# EAGLE design Laptimer (EAGLE 6.3)
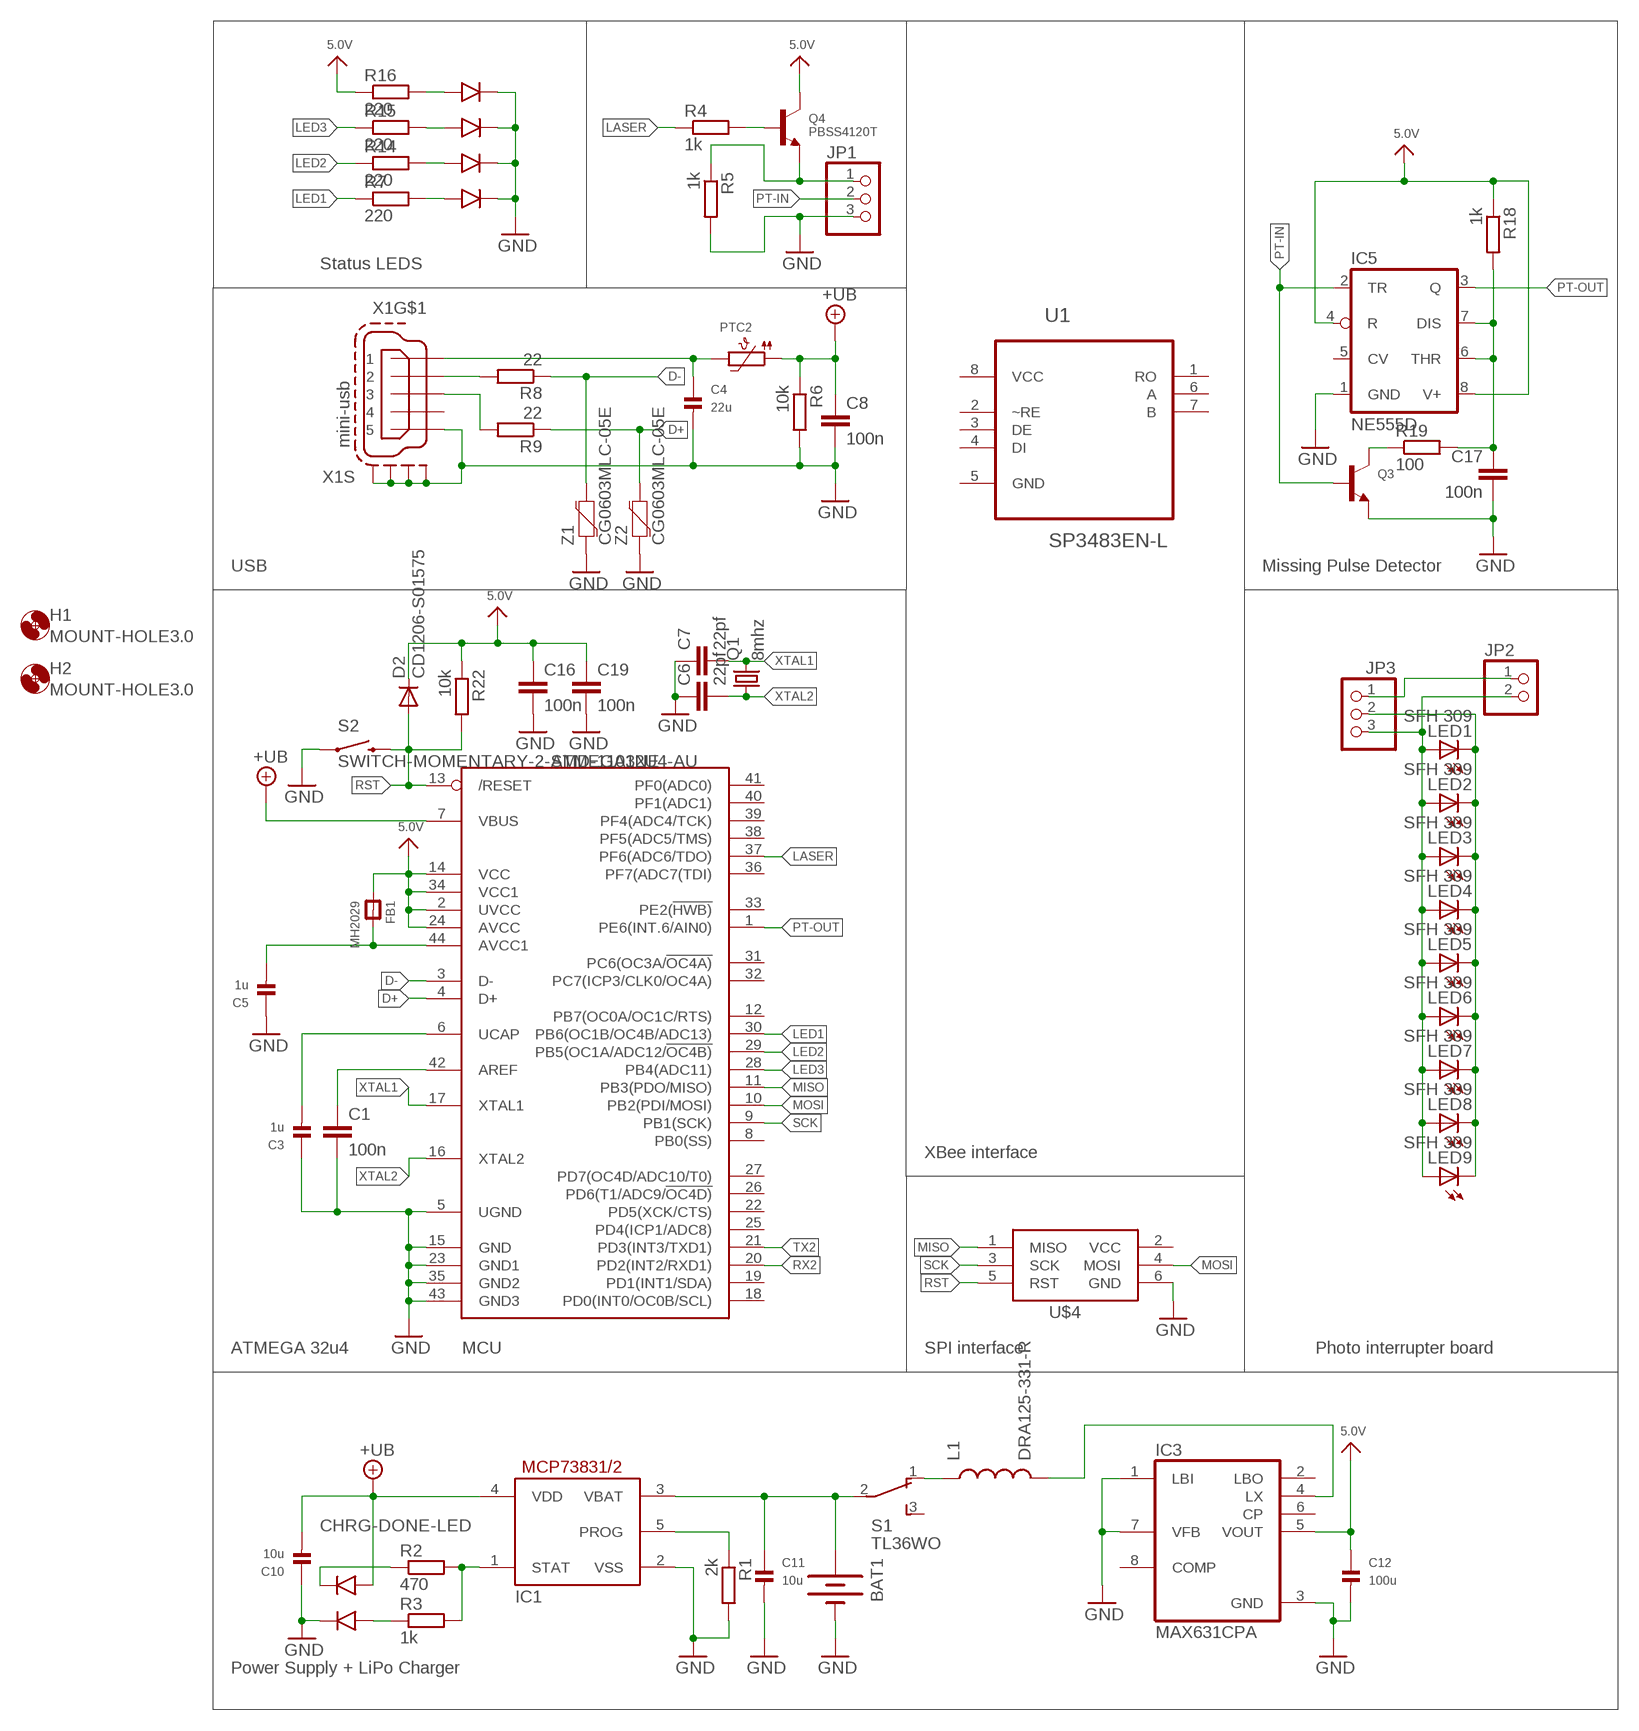
[diagram p0: schematic, sheet 1]

## Parts
BAT1  BATTERY18650  [BATTERY_18650-HOLDER]
C1  100n  C-EUC0603K  [C0603K]
C3  1u  CAP_CERAMIC_0805MP  [_0805MP]
C4  22u  CAP_CERAMIC_0805MP  [_0805MP]
C5  1u  CAP_CERAMIC_0805MP  [_0805MP]
C6  22pf  C-EUC0603K  [C0603K]
C7  22pf  C-EUC0603K  [C0603K]
C8  100n  C-EUC0603K  [C0603K]
C10  10u  CAP_CERAMIC_0805MP  [_0805MP]
C11  10u  CAP_CERAMIC_0805MP  [_0805MP]
C12  100u  CAP_CERAMIC1206  [1206]
C16  100n  C-EUC0603K  [C0603K]
C17  100n  C-EUC0603K  [C0603K]
C19  100n  C-EUC0603K  [C0603K]
D2  CD1206-S01575  DIODE-MINIMELF  [MINIMELF]
FB1  MH2029  FERRITE_0805MP  [_0805MP]
H1  MOUNT-HOLE3.0  [3,0]
H2  MOUNT-HOLE3.0  [3,0]
IC1  MCP73831/OT  [SOT23-5L]
IC3  MAX631CPA  [DIL08]
IC5  NE555D  [SO08]
JP1  PINHD-1X3  [1X03]
JP2  HEADER-1X2ROUND  [1X02_ROUND]
JP3  PINHD-1X3  [1X03]
L1  DRA125-331-R  INDUCTORPWR  [CDRH125]
LED1  SFH 309  LED3MM  [LED3MM]
LED2  SFH 309  LED3MM  [LED3MM]
LED3  SFH 309  LED3MM  [LED3MM]
LED4  SFH 309  LED3MM  [LED3MM]
LED5  SFH 309  LED3MM  [LED3MM]
LED6  SFH 309  LED3MM  [LED3MM]
LED7  SFH 309  LED3MM  [LED3MM]
LED8  SFH 309  LED3MM  [LED3MM]
LED9  SFH 309  LED3MM  [LED3MM]
MCU  ATMEGA32U4-AU  [TQFP44]
PTC2  PTC1206  [1206]
Q1  8mhz  CRYSTALHC49S  [HC49/S]
Q3  TRANSISTOR_NPNWIDE  [SOT23-WIDE]
Q4  PBSS4120T  TRANSISTOR_NPNWIDE  [SOT23-WIDE]
R1  2k  R-EU_R0603  [R0603]
R2  470  R-EU_R0603  [R0603]
R3  1k  R-EU_R0603  [R0603]
R4  1k  R-EU_R0603  [R0603]
R5  1k  R-EU_R0603  [R0603]
R6  10k  R-EU_R0603  [R0603]
R7  220  R-EU_R0603  [R0603]
R8  22  R-EU_R0603  [R0603]
R9  22  R-EU_R0603  [R0603]
R14  220  R-EU_R0603  [R0603]
R15  220  R-EU_R0603  [R0603]
R16  220  R-EU_R0603  [R0603]
R18  1k  R-EU_R0603  [R0603]
R19  100  R-EU_R0603  [R0603]
R22  10k  R-EU_R0603  [R0603]
S1  TL36WO  [TL3XWO]
S2  SWITCH-MOMENTARY-2-SMD-1101NE  [TACTILE-SWITCH-1101NE]
U1  SP3483EN-L  [SOIC127P600X175-8N]
U$1  BI-LEVEL-LED-INDICATOR  [BI-LEVEL-LED-INDICATOR]
U$4  AVRISP-BOX  [AVRISP-BOX]
U$18  BI-LEVEL-LED-INDICATOR  [BI-LEVEL-LED-INDICATOR]
U$19  BI-LEVEL-LED-INDICATOR  [BI-LEVEL-LED-INDICATOR]
X1  mini-usb  MINI-USB-SCHIELD-32005-301  [32005-301]
Z1  CG0603MLC-05E  VARISTOR-0603  [0603-RES]
Z2  CG0603MLC-05E  VARISTOR-0603  [0603-RES]

## Nets
5.0V: C12.1 C16.1 C19.1 D2.C FB1.1 IC3.5(VOUT) IC5.4(R) IC5.8(V+) MCU.2(UVCC) MCU.14(VCC) MCU.24(AVCC) MCU.34(VCC1) Q4.3(C) R16.1 R18.1 R22.1
+UB: C8.1 C10.2 IC1.4(VDD) MCU.7(VBUS) PTC2.1 R6.1 U$1.ANODE1
CHRG-DONE-LED: R3.1 U$1.ANODE2
D+: MCU.4(D+) R9.1 Z2.2
D-: MCU.3(D-) R8.1 Z1.2
GND: BAT1.GND@1(-) C1.2 C3.1 C4.2 C5.1 C6.1 C7.1 C8.2 C10.1 C11.2 C12.2 C16.2 C17.2 C19.2 IC1.2(VSS) IC3.1(LBI) IC3.3(GND) IC3.7(VFB) IC5.1(GND) JP1.3 MCU.5(UGND) MCU.15(GND) MCU.23(GND1) MCU.35(GND2) MCU.43(GND3) Q3.2(E) R1.2 R5.2 R6.2 S2.P$1 U$1.CATHODE2 U$4.6(GND) U$18.CATHODE1 U$18.CATHODE2 U$19.CATHODE1 U$19.CATHODE2 X1.5 X1.M1(S:S1) X1.M2(S:S2) X1.M3(S:S3) X1.M4(S:S4) Z1.1 Z2.1
INT: JP3.2 LED1.K(C) LED2.K(C) LED3.K(C) LED4.K(C) LED5.K(C) LED6.K(C) LED7.K(C) LED8.K(C) LED9.K(C)
LASER: MCU.37(PF6(ADC6/TDO)) R4.1
LED1: MCU.30(PB6(OC1B/OC4B/ADC13)) R7.1
LED2: MCU.29(PB5(OC1A/ADC12/!OC4B)) R14.1
LED3: MCU.28(PB4(ADC11)) R15.1
MISO: MCU.11(PB3(PDO/MISO)) U$4.1(MISO)
MOSI: MCU.10(PB2(PDI/MOSI)) U$4.4(MOSI)
N$1: R9.2 X1.3
N$3: IC1.5(PROG) R1.1
N$4: IC1.1(STAT) R2.2 R3.2
N$5: JP1.1 Q4.2(E) R5.1
N$6: Q4.1(B) R4.2
N$7: C5.2 FB1.2 MCU.44(AVCC1)
N$9: C1.1 MCU.42(AREF)
N$10: JP2.1 JP3.1
N$12: C3.2 MCU.6(UCAP)
N$13: C4.1 PTC2.2 X1.1
N$14: R2.1 U$1.CATHODE1
N$15: R7.2 U$18.ANODE1
N$21: R14.2 U$18.ANODE2
N$24: IC3.4(LX) L1.2
N$25: R15.2 U$19.ANODE1
N$26: L1.1 S1.1(O)
N$27: R8.2 X1.2
N$31: BAT1.PWR@1(+) C11.1 IC1.3(VBAT) S1.2(P)
N$32: R16.2 U$19.ANODE2
N$36: C17.1 IC5.6(THR) IC5.7(DIS) R18.2 R19.2
N$40: JP2.2 JP3.3 LED1.A LED2.A LED3.A LED4.A LED5.A LED6.A LED7.A LED8.A LED9.A
N$41: Q3.3(C) R19.1
PT-IN: IC5.2(TR) JP1.2 Q3.1(B)
PT-OUT: IC5.3(Q) MCU.1(PE6(INT.6/AIN0))
RST: D2.A MCU.13(/RESET) R22.2 S2.P$2 U$4.5(RST)
RX2: MCU.20(PD2(INT2/RXD1))
SCK: MCU.9(PB1(SCK)) U$4.3(SCK)
TX2: MCU.21(PD3(INT3/TXD1))
XTAL1: C7.2 MCU.17(XTAL1) Q1.2
XTAL2: C6.2 MCU.16(XTAL2) Q1.1
Unconnected: IC3.2(LBO) IC3.6(CP) IC3.8(COMP) IC5.5(CV) MCU.8(PB0(SS)) MCU.12(PB7(OC0A/OC1C/RTS)) MCU.18(PD0(INT0/OC0B/SCL)) MCU.19(PD1(INT1/SDA)) MCU.22(PD5(XCK/CTS)) MCU.25(PD4(ICP1/ADC8)) MCU.26(PD6(T1/ADC9/!OC4D)) MCU.27(PD7(OC4D/ADC10/T0)) MCU.31(PC6(OC3A/!OC4A)) MCU.32(PC7(ICP3/CLK0/OC4A)) MCU.33(PE2(!HWB)) MCU.36(PF7(ADC7(TDI)) MCU.38(PF5(ADC5/TMS)) MCU.39(PF4(ADC4/TCK)) MCU.40(PF1(ADC1)) MCU.41(PF0(ADC0)) S1.3(S) U1.1(RO) U1.2(~RE) U1.3(DE) U1.4(DI) U1.5(GND) U1.6(A) U1.7(B) X1.4

## Notes on the sheet
- Status LEDS
- USB | Missing Pulse Detector
- XBee interface
- ATMEGA 32u4 | SPI interface | Photo interrupter board
- Power Supply + LiPo Charger

## Power pins joined to a net without a drawn wire
VCC: U1.8(VCC) U$4.2(VCC)

## Library data of the parts
BAT1 = SparkFun-Electromechanical:BATTERY: Battery Holders Various common sizes : AA, AAA, 18650 (PRT-12895), 20mm coin cell and 12mm coin cell. 20MM_4LEGS, BATT-10373
C1 C6-C8 C16 C17 C19 = rcl:C-EU: CAPACITOR, European symbol
C3-C5 C10-C12 = microbuilder:CAP_CERAMIC: Ceramic Capacitors 0402 - 0402 Surface Mount Capacitors 16pF 50V 5% [Digikey: 445-4899-2-ND] 18pF 50V 5% [Digikey: 490-1281-2-ND] 22pF 50V 5% [Digikey: 490-1283-2-ND] 68pF 50V 5% [Digikey: 490-1289-2-ND] 0.1uF 10V 10% [Digikey: 490-1318-2-ND] 1.0uF 6.3V 10% [Digikey: 490-1320-2-ND] 0603 - 0603 Surface Mount Capacitors 16 pF 50V 5% [Digikey: 445-5051-2-ND] 22 pF 50V [Digikey: PCC220ACVTR-ND] 33 pF 50V 5% [Digikey: 490-1415-1-ND] 56pF 50V 5% [Digikey: 490-1421-1-ND] 220pF 50V 5% [Digikey: 445-1285-1-ND] 680 pF 50V 2200 pF 50V 5% C0G [Digikey: 445-1297-1-ND] 5600 pF 100V 5% X7R [Digikey: 478-3711-1-ND] 0.1 µF 25V 10% [Digikey: PCC2277TR-ND] 0.22 µF 16V 10% X7R [Digikey: 445-1318-1-ND] 1.0 µF 25V 10% [Digikey: 445-5146-2-ND] 0603 - RF Specific 3pF 250V +/-0.1pF RF [Digikey: 712-1347-1-ND] 18 pF 250V 5% [Digikey: 478-3505-1-ND or 712-1322-1-ND] 56 pF 250V 5% C0G RF [Digikey: 490-4867-1-ND] 68 pF 250V RF [Digikey: 490-4868-1-ND] 0805 - 0805 Surface Mount Capacitors 220 pF 250V 2% RF Ceramic Capacitor [Digikey: 712-1398-1-ND] 1000 pF 50V 2% NP0 Ceramic Capacitor [Digikey: 478-3760-1-ND] 0.1 µF 25V 10% Ceramic Capacitor [Digikey: PCC1828TR-ND] 1.0 µF 16V 10% Ceramic Capacitor[Digikey: 490-1691-2-ND] 10.0 µF 10V 10% Ceramic Capacitor[Digikey: 709-1228-1-ND] 10.0 uF 16V 10% Ceramic Capacitor [Digikey: 478-5165-2-ND] 47 uF 6.3V 20% Ceramic Capacitor [Digikey: 587-1779-1-ND or 399-5506-1-ND] 1206 - 1206 Surface Mount Capacitors 47uF 10V 20% Ceramic Capacitor [Digikey: 490-5528-1-ND or 399-5508-1-ND or 445-6010-1-ND] 100uF 6.3V -20%, +80% Y5V Ceramic Capacitor (Digikey: 490-4512-1-ND, Mouser: 81-GRM31CF50J107ZE1L)
D2 = diode:DIODE-: DIODE
FB1 = microbuilder:FERRITE: Ferrite Bead 0603 MMZ1608B121C - 120 Ohm @ 100MHz, 600mA, 0.15 Ohm DC Resistance - Digikey: 445-2164-1-ND BK1608HW121-T - 120 Ohm, 600mA Ferrite Chip - Digikey: 587-1876-2-ND 0805 HZ0805B272R-10 - 2.7K Ohm @ 100MHz, 200mA, 0.8 Ohm DC Resistance - Digikey: 240-2504-1-ND (see also Murata BLM21BD272SN1L) MMZ2012Y152B - 1.5K Ohm @ 100MHz, 500mA, 0.4 Ohm DC Resistance - Digikey: 445-1560-1-ND - Mainly for high frequency (80-400MHz) MMZ2012R102A - 1K Ohm @ 100MHz, 500mA, 0.3 Ohm DC Resistance - Digikey: 445-1555-2-ND - More general purpose (10-200MHz)
H1 H2 = holes:MOUNT-HOLE: MOUNTING HOLE with drill center marker
IC1 = adafruit:MCP73831: MCP73831/2 Miniature Single-Cell, Fully Integrated Li-Ion, Li-Polymer Charge Management Controllers. Nice and small simple lipoly charge controller, with adjustable current and status output (LED) http://www.ladyada.net/library/pcb/eaglelibrary.html
IC3 = maxim:MAX631CPA: Step-up SWITCHING REGULATOR; OC_FARNELL: unknown; OC_NEWARK: unknown
IC5 = linear:*555: TIMER
JP1 JP3 = adafruit:PINHD-1X3: PIN HEADER
JP2 = microbuilder:HEADER-1X2: PIN HEADER
L1 = SparkFun-Passives:INDUCTOR: Inductors Basic Inductor/Choke - 0603 and 1206. Footprints are not proven and vary greatly between part numbers. INDUCTOR POWER 3.3UH 4.0A SMD 0.197" L x 0.197" W x 0.177" H (5.00mm x 5.00mm x 4.50mm)
LED1-LED9 = adafruit:LED: LED OSRAM: - CHIPLED LG R971, LG N971, LY N971, LG Q971, LY Q971, LO R971, LY R971 LH N974, LH R974 LS Q976, LO Q976, LY Q976 LO Q996 - Hyper CHIPLED LW Q18S LB Q993, LB Q99A, LB R99A - SideLED LS A670, LO A670, LY A670, LG A670, LP A670 LB A673, LV A673, LT A673, LW A673 LH A674 LY A675 LS A676, LA A676, LO A676, LY A676, LW A676 LS A679, LY A679, LG A679 - Hyper Micro SIDELED® LS Y876, LA Y876, LO Y876, LY Y876 LT Y87S - SmartLED LW L88C, LW L88S LB L89C, LB L89S, LG L890 LS L89K, LO L89K, LY L89K LS L896, LA L896, LO L896, LY L896 - TOPLED LS T670, LO T670, LY T670, LG T670, LP T670 LSG T670, LSP T670, LSY T670, LOP T670, LYG T670 LG T671, LOG T671, LSG T671 LB T673, LV T673, LT T673, LW T673 LH T674 LS T676, LA T676, LO T676, LY T676, LB T676, LH T676, LSB T676, LW T676 LB T67C, LV T67C, LT T67C, LS T67K, LO T67K, LY T67K, LW E67C LS E67B, LA E67B, LO E67B, LY E67B, LB E67C, LV E67C, LT E67C LW T67C LS T679, LY T679, LG T679 LS T770, LO T770, LY T770, LG T770, LP T770 LB T773, LV T773, LT T773, LW T773 LH T774 LS E675, LA E675, LY E675, LS T675 LS T776, LA T776, LO T776, LY T776, LB T776 LHGB T686 LT T68C, LB T68C - Hyper Mini TOPLED® LB M676 - Mini TOPLED Santana® LG M470 LS M47K, LO M47K, LY M47K Source: http://www.osram.convergy.de/
MCU = adafruit:ATMEGA32U4: http://www.ladyada.net/library/eagle
PTC2 = microbuilder:PTC: PTC (Resettable Fuse) 1206 Package 250mA PTC (16V Max, Time-to-Trip: 0.08s) - Digikey: F2110CT-ND 1210 Package 100mA PTC (30V Max, Time-to-Trip: 0.6s) - Digikey: MF-USMF010-2CT-ND 1812 Package 750mA PTC (24V Max, Time-to-Trip: 0.2s) - Digikey: MF-MSMF075/24-2CT-ND
Q1 = adafruit:CRYSTAL: CRYSTAL; OC_FARNELL: 1667008; OC_NEWARK: unknown
Q3 Q4 = microbuilder:TRANSISTOR_NPN: NPN Transistor Transistor (NPN) 500mA 45V - BC817 [Digikey: 568-1631-1-ND] Transistor (NPN) 500mA 45V - BC817,215 [Mouser: 771-BC817-T/R] SOT23-R - SOT23 footprint optimised for use with solder paste and reflow ovens. SOT23-W - SOT23 footprint optimised for hand-soldering (larger pads).
R1-R9 R14-R16 R18 R19 R22 = rcl:R-EU_: RESISTOR, European symbol
S1 = switch:TL36WO: TINY SWITCH ON - ON Source: http://www2.produktinfo.conrad.com/datenblaetter/700000-724999/705152-da-01-de-Subminiaturschalter_TL_36WO.pdf
S2 = SparkFun-Electromechanical:SWITCH-MOMENTARY-2: Various NO switches- pushbuttons, reed, etc
U1 = Exar_By_element14_Batch_1:SP3483EN-L: Transceiver; MPN: SP3483EN-L; OC_FARNELL: 1296640; OC_NEWARK: 24R0517; PACKAGE: NSOIC-8; SUPPLIER: Exar
U$1 U$18 U$19 = unicorn_v2:BI-LEVEL-LED-INDICATOR
U$4 = adafruit:AVRISP: AVR ISP HEADER Standard 6 pin header for AVR programming
X1 = con-cypressindustries:MINI-USB-SCHIELD-: MINI USB-B Conector Source: www.cypressindustries.com; OC_FARNELL: unknown; OC_NEWARK: unknown
Z1 Z2 = SparkFun-DiscreteSemi:VARISTOR: Varistor Varistor (Variable resistor) is a nonlinear resistive element of the voltage dependence that resistance changes with applied voltage. Varistor is equivalent with Zener diode of two series connection.

## Board
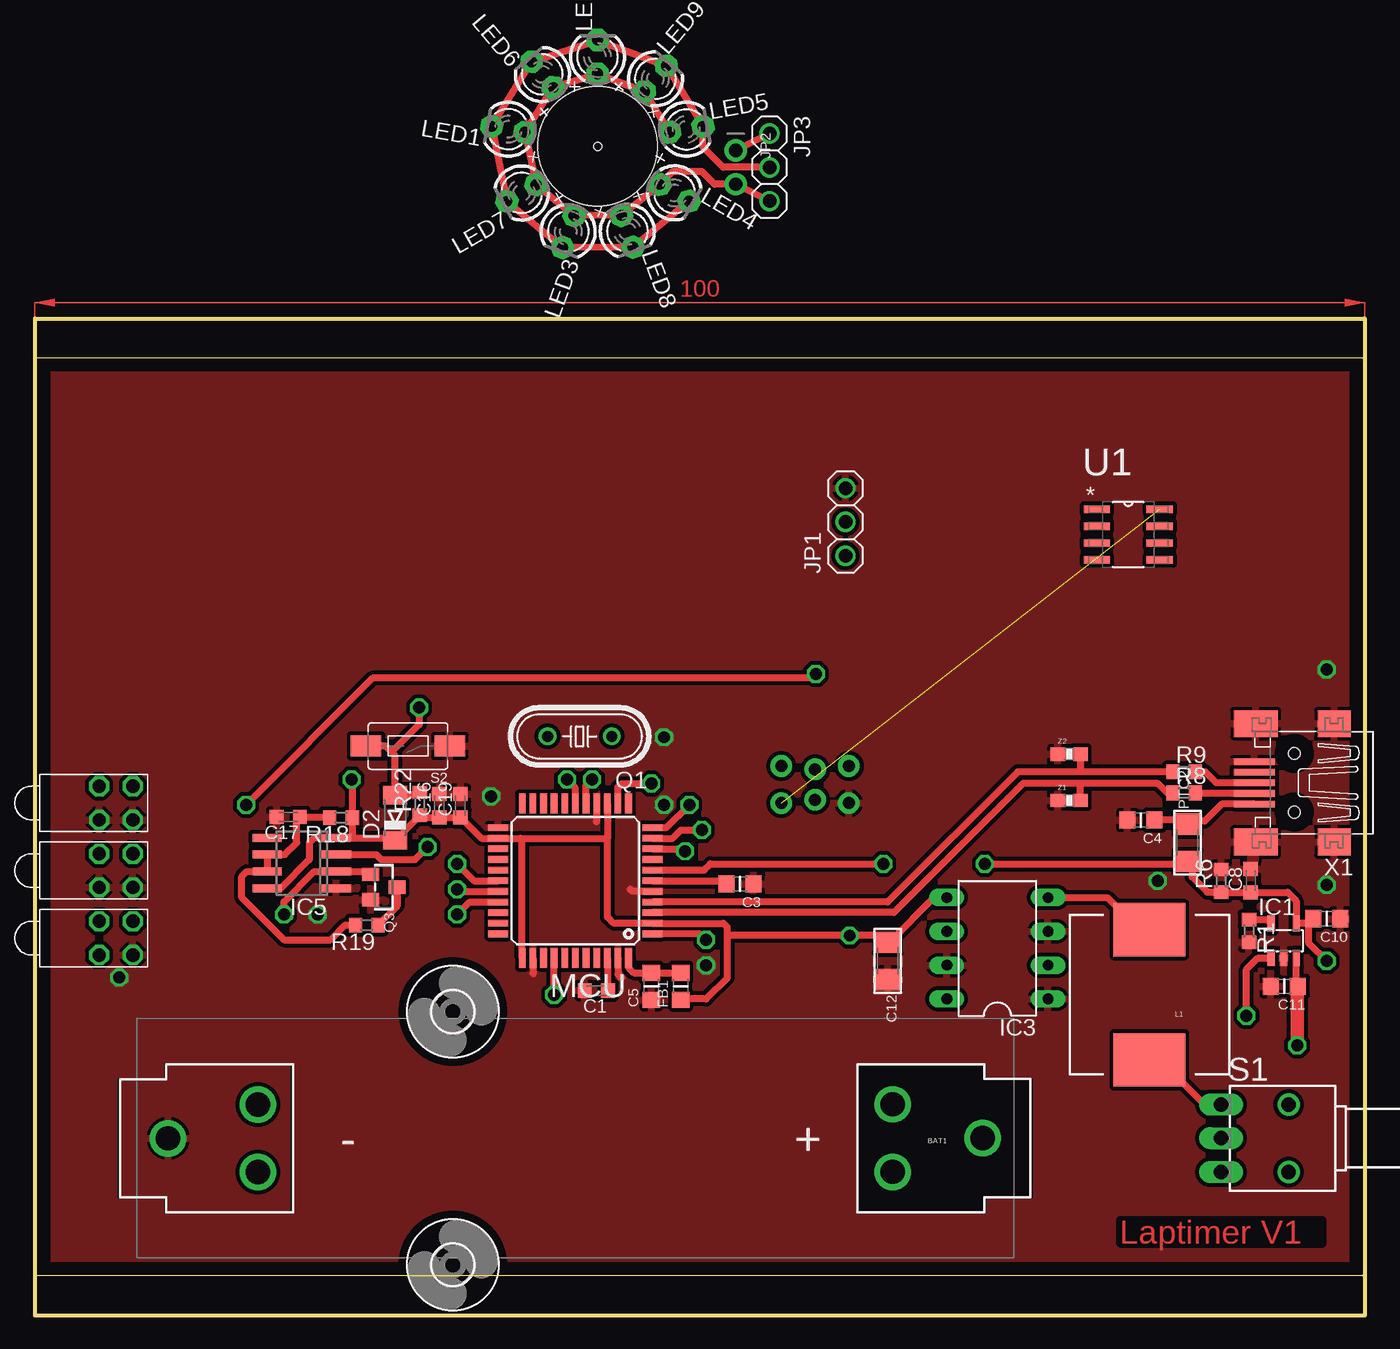
[diagram p1: board, top side]
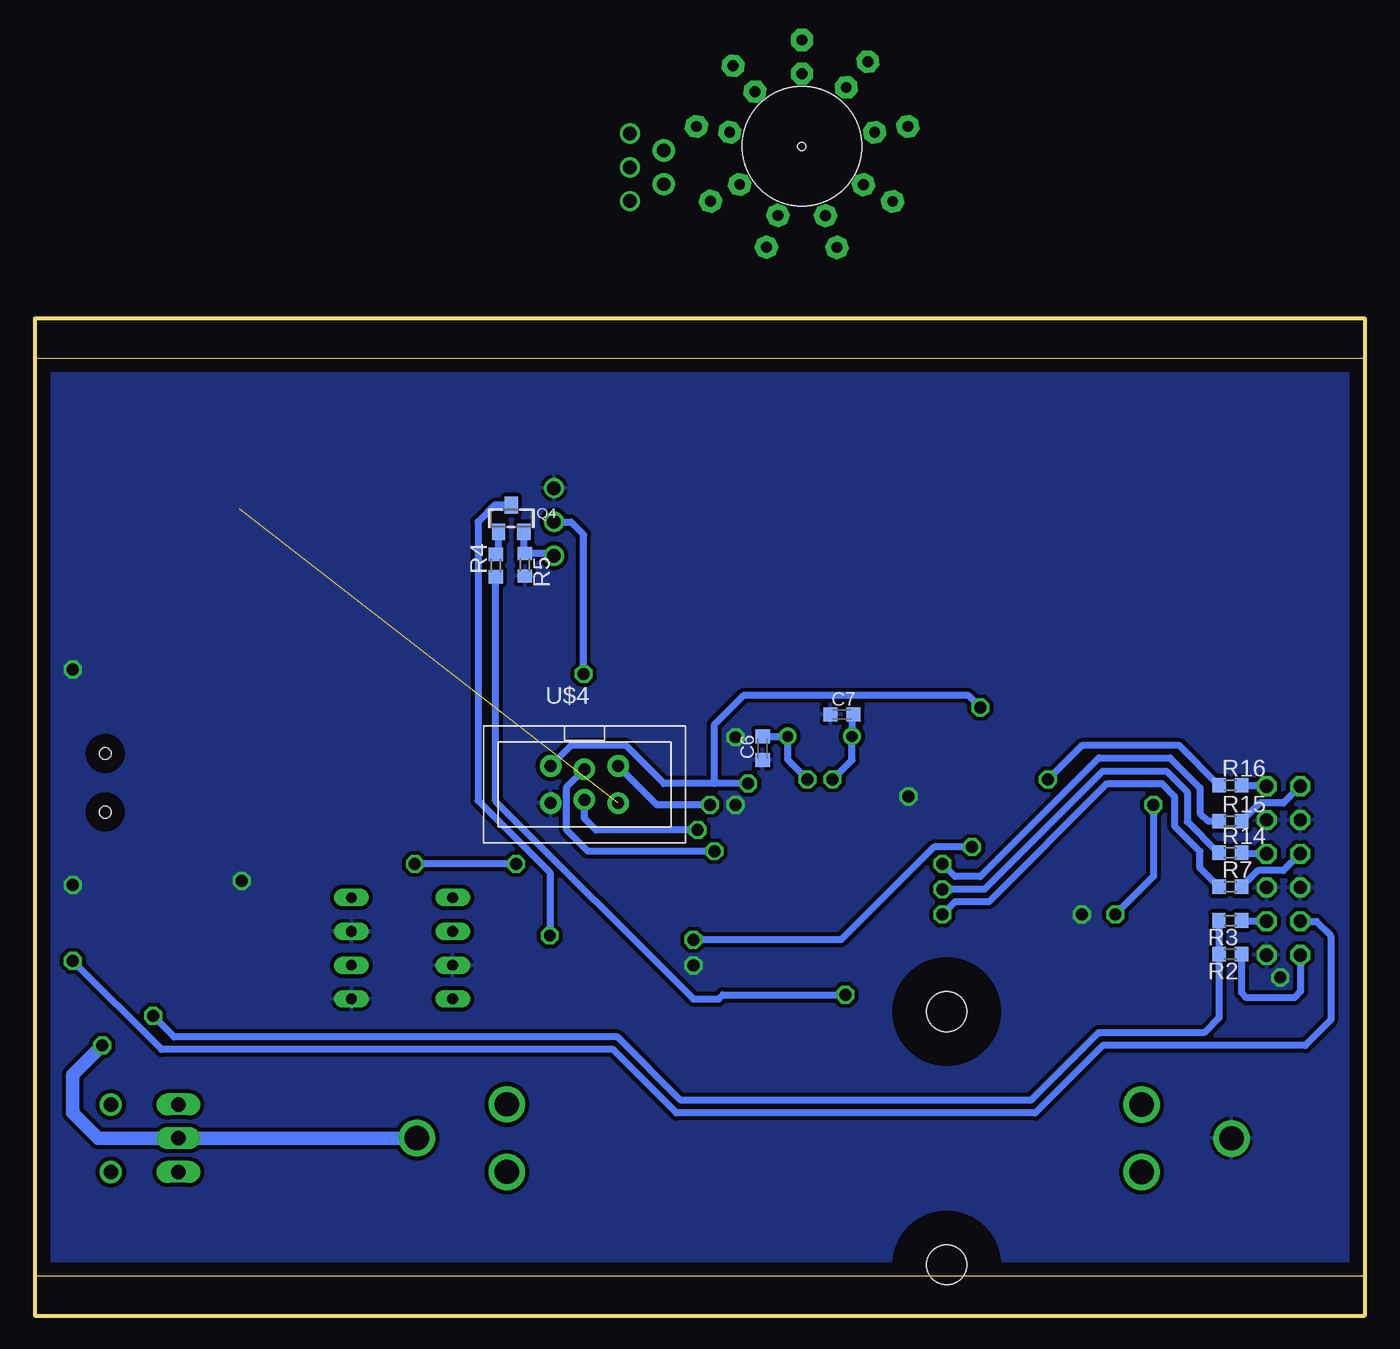
[diagram p2: board, bottom side, seen from below]

Size 100 x 75 mm. Coordinates in mm from the lower left corner, seen from the top.
Outline: 0,72 0,75 100,75 100,72
Outline: 0,72 0,3
Outline: 0,3 0,0 100,0 100,3
Outline: 100,72 100,3
Outline: 100,3 0,3
Outline: 100,72 0,72
Copper layers (1*16): Top 0.035mm / dielectric 1.5mm / Bottom 0.035mm
Design rules "default *": minimum track width 12mil, minimum drill 24mil, track to track 12mil, track to pad 12mil, pad to pad 12mil, via to via 12mil, smd to smd 12mil, copper to edge 40mil, drill to drill 8mil, minimum pad ring 10mil, minimum via ring 8mil, stop-mask expansion 4mil, vias tented up to drill 0mil, thermal gap 10mil
Holes 9 mm at 42.32,87.94
Holes 0.6 mm at 42.32,87.94

### Footprints (pad centres in the part's own frame; a part is rotated, then mirrored left to right if it is on the bottom)
BATTERY_18650-HOLDER = drill 1.829: GND@1 30.628,0.01; GND@2 23.88,2.55; GND@3 23.88,-2.53; PWR@1 -30.628,-0.01; PWR@2 -23.88,2.53; PWR@3 -23.88,-2.55
C0603K = smd 1.05 x 1.08: 1 -0.875,0; 2 0.875,0
_0805MP = smd 1.2 x 1.3: 1 -1.016,0; 2 1.016,0
1206 = smd 1.6 x 1.8: 1 -1.4,0; 2 1.4,0
MINIMELF = smd 1.4 x 1.8: A 1.7,0; C -1.7,0
3,0 = hole 3: 0,0
SOT23-5L = smd 0.55 x 1.2: 1 -0.95,-1.3; 2 0,-1.3; 3 0.95,-1.3; 4 0.95,1.3; 5 -0.95,1.3
DIL08 = drill 0.813 long: 1 -3.81,-3.81; 2 -1.27,-3.81; 3 1.27,-3.81; 4 3.81,-3.81; 5 3.81,3.81; 6 1.27,3.81; 7 -1.27,3.81; 8 -3.81,3.81
SO08 = smd 0.6 x 2.2: 1 -1.905,-2.6; 2 -0.635,-2.6; 3 0.635,-2.6; 4 1.905,-2.6; 5 1.905,2.6; 6 0.635,2.6; 7 -0.635,2.6; 8 -1.905,2.6
1X03 = drill 1.016: 1 -2.54,0; 2 0,0; 3 2.54,0
1X02_ROUND = drill 1 pad 1.676: 1 -1.27,0; 2 1.27,0
CDRH125 = smd 5.4 x 4: 1 0,4.9; 2 0,-4.9
LED3MM = drill 0.813 pad 1.676 octagon: A -1.27,0; K 1.27,0
TQFP44 = smd 1.5 x 0.5: 1 -5.8,4; 2 -5.8,3.2; 3 -5.8,2.4; 4 -5.8,1.6; 5 -5.8,0.8; 6 -5.8,0; 7 -5.8,-0.8; 8 -5.8,-1.6; 9 -5.8,-2.4; 10 -5.8,-3.2; 11 -5.8,-4; 23 5.8,-4; 24 5.8,-3.2; 25 5.8,-2.4; 26 5.8,-1.6; 27 5.8,-0.8; 28 5.8,0; 29 5.8,0.8; 30 5.8,1.6; 31 5.8,2.4; 32 5.8,3.2; 33 5.8,4 | smd 0.5 x 1.5: 12 -4,-5.8; 13 -3.2,-5.8; 14 -2.4,-5.8; 15 -1.6,-5.8; 16 -0.8,-5.8; 17 0,-5.8; 18 0.8,-5.8; 19 1.6,-5.8; 20 2.4,-5.8; 21 3.2,-5.8; 22 4,-5.8; 34 4,5.8; 35 3.2,5.8; 36 2.4,5.8; 37 1.6,5.8; 38 0.8,5.8; 39 0,5.8; 40 -0.8,5.8; 41 -1.6,5.8; 42 -2.4,5.8; 43 -3.2,5.8; 44 -4,5.8
HC49/S = drill 0.813: 1 -2.413,0; 2 2.413,0
SOT23-WIDE = smd 1 x 1.27: 1 -0.95,-1; 2 0.95,-1; 3 0,1
R0603 = smd 1 x 1.1: 1 -0.85,0; 2 0.85,0
TL3XWO = drill 1.1 pad 1.422 long: 1 -2.54,-5.08; 2 0,-5.08; 3 2.54,-5.08 | drill 1.1 pad 1.676: M1 -2.54,0; M2 2.54,0
TACTILE-SWITCH-1101NE = smd 2.3 x 1.6: P$1 -3.15,0; P$2 3.15,0
SOIC127P600X175-8N = smd 1.981 x 0.559: 1 -2.362,1.905; 2 -2.362,0.635; 3 -2.362,-0.635; 4 -2.362,-1.905; 5 2.362,-1.905; 6 2.362,-0.635; 7 2.362,0.635; 8 2.362,1.905
BI-LEVEL-LED-INDICATOR = drill 1 octagon: ANODE1 1.27,1.27; ANODE2 1.27,-1.27; CATHODE1 -1.27,1.27; CATHODE2 -1.27,-1.27
AVRISP-BOX = drill 0.9 pad 1.626: 1 -1.397,2.54; 2 1.397,2.54; 3 -1.143,0; 4 1.143,0; 5 -1.397,-2.54; 6 1.397,-2.54
32005-301 = smd 3.1 x 0.5: 1 3,1.6; 2 3,0.8; 3 3,0; 4 3,-0.8; 5 3,-1.6 | smd 2.5 x 2: M1 -3,-4.45; M2 -3,4.45 | smd 3.3 x 2: M3 2.9,4.45; M4 2.9,-4.45 | hole 0.9: 0,2.2; 0,-2.2
0603-RES = smd 1.1 x 1: 1 -0.85,0; 2 0.85,0

### Placement (x,y rotation side)
BAT1  40.64,13.34 180 top
C1  42.23,24.45 180 top
C3  53.03,32.46 180 top
C4  83.19,37.27 180 top
C5  46.35,24.77 90 top
C6  45.28,42.67 90 bottom
C7  39.3,45.21 0 bottom
C8  91.44,32.7 90 top
C10  97.16,29.84 180 top
C11  93.98,24.77 180 top
C12  64.14,26.67 270 top
C16  30.42,38.35 90 top
C17  19.05,37.5 180 top
C19  32,38.35 90 top
D2  27.08,37.44 90 top
FB1  48.58,24.77 90 top
H1  31.43,22.86 0 top
H2  31.43,3.81 0 top
IC1  93.92,28.19 0 top
IC3  72.39,27.62 90 top
IC5  20.07,34.03 90 top
JP1  60.96,59.69 90 top
JP2  52.7,86.36 270 top  (outside the outline)
JP3  55.24,86.36 270 top  (outside the outline)
L1  83.82,24.13 180 top
LED1  35.6,89.22 170 top  (outside the outline)
LED2  42.32,94.67 90 top  (outside the outline)
LED3  40.1,81.53 250 top  (outside the outline)
LED4  48.1,84.44 330 top  (outside the outline)
LED5  48.99,89.22 10 top  (outside the outline)
LED6  38.16,93.34 130 top  (outside the outline)
LED7  36.59,84.43 210 top  (outside the outline)
LED8  44.55,81.55 290 top  (outside the outline)
LED9  46.67,93.03 50 top  (outside the outline)
MCU  40.65,32.7 180 top
PTC2  86.68,35.56 90 top
Q1  40.96,43.56 180 top
Q3  26.23,32.23 270 top
Q4  64.17,59.95 0 bottom
R1  91.31,28.92 270 top
R2  10.1,27.17 180 bottom
R3  10.11,29.72 180 bottom
R4  65.35,56.42 90 bottom
R5  63.15,56.47 270 bottom
R6  89.22,32.7 90 top
R7  10.1,32.26 0 bottom
R8  86.43,39.31 0 top
R9  86.43,40.89 0 top
R14  10.1,34.8 0 bottom
R15  10.1,37.18 0 bottom
R16  10.1,39.88 0 bottom
R18  23.02,37.46 180 top
R19  24.96,29.37 180 top
R22  28.96,38.49 90 top
S1  94.3,13.34 270 top
S2  28.05,42.83 180 top
U1  82.23,58.74 0 top
U$1  6.1,28.38 90 top
U$4  58.67,39.93 270 bottom
U$18  6.1,33.46 90 top
U$19  6.1,38.54 90 top
X1  94.72,40.07 180 top
Z1  77.79,38.73 0 top
Z2  77.79,42.23 0 top

### Tracks (layer width: path | path; a pad name or v marks a point on that pad's centre or on a via)
5.0V  (via drill 0.89, 0.9)
  Top 0.508: FB1.1 48.64,23.81 50.48,23.81 52.07,25.4 52.07,28.57 | MCU.14 43.05,35.9 | 36.51,35.9 MCU.24 33.57,35.9 C19.1 C16.1 29.12,37.47 R22.1 28.96,37.61 D2.C 26.89,35.93 23.87,35.93 | 36.51,35.9 43.05,35.9 | MCU.34 36.65,35.77 36.51,35.9 | 43.05,35.9 43.05,29.98 43.52,29.5 MCU.2 51.78,29.5 52.07,29.21 52.07,28.57 | 23.87,35.93 R18.1 23.87,40.27 v23.81,40.32 | 23.87,35.93 IC5.4 21.01,35.93 20.64,35.56 20.64,34.29 18.47,32.12 IC5.8 | 52.07,28.57 v61.28,28.57 63.31,28.57 C12.1 64.27,28.07 67.63,31.43 IC3.5
  Bottom 0.508: Q4.3 65.42,60.95 66.67,59.69 66.67,38.73 61.28,33.34 v61.28,28.57 | R16.1 13.93,42.86 21.27,42.86 v23.81,40.32
+UB  (via drill 0.89, 0.9)
  Top 0.508: C10.2 95.78,29.49 | 95.78,29.49 IC1.4 94.87,31.18 94.22,31.83 C8.1 89.24,31.83 R6.1 88.16,31.85 87.03,32.98 87.03,34.48 PTC2.1 86.49,33.97 v71.44,33.97 | 95.78,29.49 95.78,28.04 v97.16,26.67 | MCU.7 50.33,33.5 50.8,33.97 v63.82,33.97
  Bottom 0.508: U$1.ANODE1 3.62,29.65 2.54,28.57 2.54,22.23 4.45,20.32 19.68,20.32 24.77,15.24 51.75,15.24 56.52,20 90.49,20 v97.16,26.67 | v63.82,33.97 v71.44,33.97
CHRG-DONE-LED
  Bottom 0.508: U$1.ANODE2 9.19,29.65 R3.1
D+
  Top 0.508: R9.1 78.64,40.89 | 78.64,40.89 73.91,40.89 64.12,31.1 MCU.4 | Z2.2 78.64,40.89
D-
  Top 0.508: R8.1 85.15,39.31 84.45,40.01 78.64,40.01 | 78.64,40.01 74.3,40.01 64.59,30.3 MCU.3 | Z1.2 78.64,40.01
GND  (via drill 0.9)
  Top 0.508: MCU.43 43.85,25.69 44.13,25.4 | MCU.35 37.45,25.74 37.47,25.72 | MCU.15 42.25,37.17 42.23,37.15 | MCU.5 44.93,31.9 44.77,32.07
  other vias: 47.31,43.5 6.34,25.42 47.31,38.42 50.48,26.35 21.27,30.16 97.16,32.38 97.16,48.58 84.45,32.7 34.29,39.05
  pour Top: 0,72.33 100.14,72.33 100.14,3.12 0.13,3.12
  pour Bottom: 0,72.33 100.14,72.33 100.14,3.12 0.13,3.12
INT
  Top 0.508: LED4.K LED8.K LED3.K LED7.K LED1.K LED6.K LED2.K LED9.K LED5.K 50.24,87.87 51.75,86.36 JP3.2
LASER  (via drill 0.9)
  Top 0.508: v39.05,24.13 MCU.37
  Bottom 0.508: v39.05,24.13 48.26,24.13 48.58,23.81 50.48,23.81 65.35,38.68 R4.1
LED1  (via drill 0.9)
  Top 0.508: v31.75,30.16 32.69,31.1 MCU.30
  Bottom 0.508: R7.1 10.99,32.26 12.38,33.66 12.38,34.92 14.29,36.83 14.29,39.05 15.24,40.01 19.37,40.01 28.26,31.11 30.8,31.11 v31.75,30.16
LED2  (via drill 0.9)
  Top 0.508: v31.75,32.07 31.91,31.9 MCU.29
  Bottom 0.508: R14.1 10.99,34.8 13.34,37.15 13.34,39.37 14.92,40.96 19.68,40.96 28.57,32.07 v31.75,32.07
LED3  (via drill 0.9)
  Top 0.508: v31.75,33.97 33.02,32.7 MCU.28
  Bottom 0.508: v31.75,33.97 30.8,33.02 28.89,33.02 19.97,41.95 14.64,41.95 12.38,39.69 12.38,37.78 11.78,37.18 R15.1
MISO  (via drill 0.9)
  Top 0.508: MCU.11 47.5,36.7 v49.21,38.42
  Bottom 0.508: v49.21,38.42 53.22,38.42 U$4.1
MOSI  (via drill 0.9)
  Top 0.508: MCU.10 47.97,35.9 48.58,36.51 v50.16,36.51
  Bottom 0.508: v50.16,36.51 57.78,36.51 58.67,37.4 U$4.4
N$1
  Top 0.508: X1.3 88.84,40.07 88.01,40.89 R9.2
N$2  (via drill 0.9)
  other vias: 31.43,22.86
N$3
  Top 0.508: IC1.5 92.68,29.77 R1.1
N$4  (via drill 0.9)
  Top 0.508: v91.12,22.54 91.12,26.04 91.97,26.89 IC1.1
  Bottom 0.508: R3.2 10.96,27.18 | 10.96,27.18 R2.2 | 10.96,27.18 10.96,22.38 12.06,21.27 20,21.27 25.08,16.19 51.44,16.19 56.2,20.95 89.53,20.95 v91.12,22.54
N$5
  Bottom 0.508: JP1.1 61.13,57.32 R5.1 63.23,57.39 Q4.2
N$6
  Bottom 0.508: R4.2 65.12,57.49 Q4.1
N$7
  Top 0.508: MCU.44 44.65,26.16 45.02,25.78 C5.2 FB1.2
N$8  (via drill 0.6)
  other vias: 42.32,87.94
N$9
  Top 0.508: MCU.42 43.05,24.5 C1.1
N$10
  Top 0.508: JP3.1 JP2.1
N$12
  Top 0.508: MCU.6 51.82,32.7 C3.2
N$13
  Top 0.508: X1.1 89.27,38.47 87.98,37.18 86.68,37.18 PTC2.2 86.68,37.27 C4.1
N$14
  Bottom 0.508: U$1.CATHODE1 4.83,24.36 5.28,23.91 8.89,23.91 9.25,24.27 R2.1
N$15
  Bottom 0.508: U$18.ANODE1 6.1,33.47 8.04,33.47 R7.2
N$16  (via drill 0.9)
  other vias: 31.43,3.81
N$21
  Bottom 0.508: U$18.ANODE2 9.18,34.73 R14.2
N$24
  Top 0.508: IC3.4 80.64,31.43 82.55,29.53 83.32,29.53 L1.2
N$25
  Bottom 0.508: U$19.ANODE1 6.09,38.55 7.88,38.55 R15.2
N$26
  Top 0.508: S1.1 87.95,15.88 85.09,18.73 84.32,18.73 L1.1
N$27
  Top 0.508: X1.2 87.28,39.27 R8.2
N$31  (via drill 0.9)
  Top 0.508: C11.1 94.87,24.89 IC1.3
  Top 1.016: v94.93,20.32 94.93,24.7 C11.1
  Bottom 1.016: BAT1.PWR@1 S1.2 95.25,13.34 97.16,15.24 97.16,18.1 v94.93,20.32
N$32
  Bottom 0.508: U$19.ANODE2 9.25,39.81 R16.2
N$36
  Top 0.508: R18.2 22.12,37.5 C17.1 19.68,37.26 19.68,35.56 18.79,34.66 IC5.6 IC5.7 15.93,33.39 15.56,33.02 15.56,31.43 18.73,28.26 22.23,28.26 23.34,29.37 R19.2
N$40
  Top 0.508: LED5.A LED9.A LED2.A LED6.A LED1.A LED7.A LED3.A LED8.A LED4.A 47.96,86.04 50.16,86.04 51.12,85.09 JP2.2 JP3.3
N$41
  Top 0.508: Q3.3 27.23,30.79 R19.1
PT-IN  (via drill 0.9)
  Top 0.508: Q3.1 25.23,33.39 IC5.2 21.01,33.39 18.73,31.11 v18.73,30.16 | v15.88,38.42 25.4,47.94 58.42,47.94 v58.74,48.26
  Bottom 0.508: JP1.2 59.69,59.69 58.74,58.74 v58.74,48.26 | v15.88,38.42 15.88,33.02 v18.73,30.16
PT-OUT  (via drill 0.9)
  Top 0.508: IC5.3 25.66,34.66 26.04,34.29 28.57,34.29 v29.53,35.24 | v50.48,28.26 50.04,28.7 MCU.1
  Bottom 0.508: v29.53,35.24 32.38,35.24 39.37,28.26 v50.48,28.26
RST  (via drill 0.9)
  Top 0.508: R22.2 28.76,39.14 D2.A 27.08,42.13 26.83,42.39 | MCU.13 43.85,39.72 44.13,40.01 v46.35,40.01 | 26.83,42.39 26.38,42.83 S2.P$2 | v28.89,45.72 28.89,44.45 26.83,42.39
  Bottom 0.508: U$4.5 59.68,42.86 55.56,42.86 52.7,40.01 v46.35,40.01 48.9,40.01 48.9,44.45 46.67,46.67 29.84,46.67 v28.89,45.72
SCK  (via drill 0.9)
  Top 0.508: MCU.9 48.72,35.1 v48.9,34.92
  Bottom 0.508: v48.9,34.92 58.42,34.92 60.01,36.51 60.01,39.74 U$4.3
VCC  (1 unrouted)
XTAL1  (via drill 0.9)
  Top 0.508: MCU.17 40.65,39.68 v40.01,40.32
  Bottom 0.508: v40.01,40.32 38.55,41.78 Q1.2 38.55,45.09 C7.2
XTAL2  (via drill 0.9)
  Top 0.508: MCU.16 41.45,39.86 v41.91,40.32
  Bottom 0.508: v41.91,40.32 43.38,41.79 Q1.1 45.26,43.56 C6.2
(copper drawn outside any net)
  shapes: Top area x3

### Text on the board
Top: Laptimer V1